# Altium schematic sheet SW 12.schdoc
size 349 x 127 mm; SheetNumber: 1; SheetTotal: 1
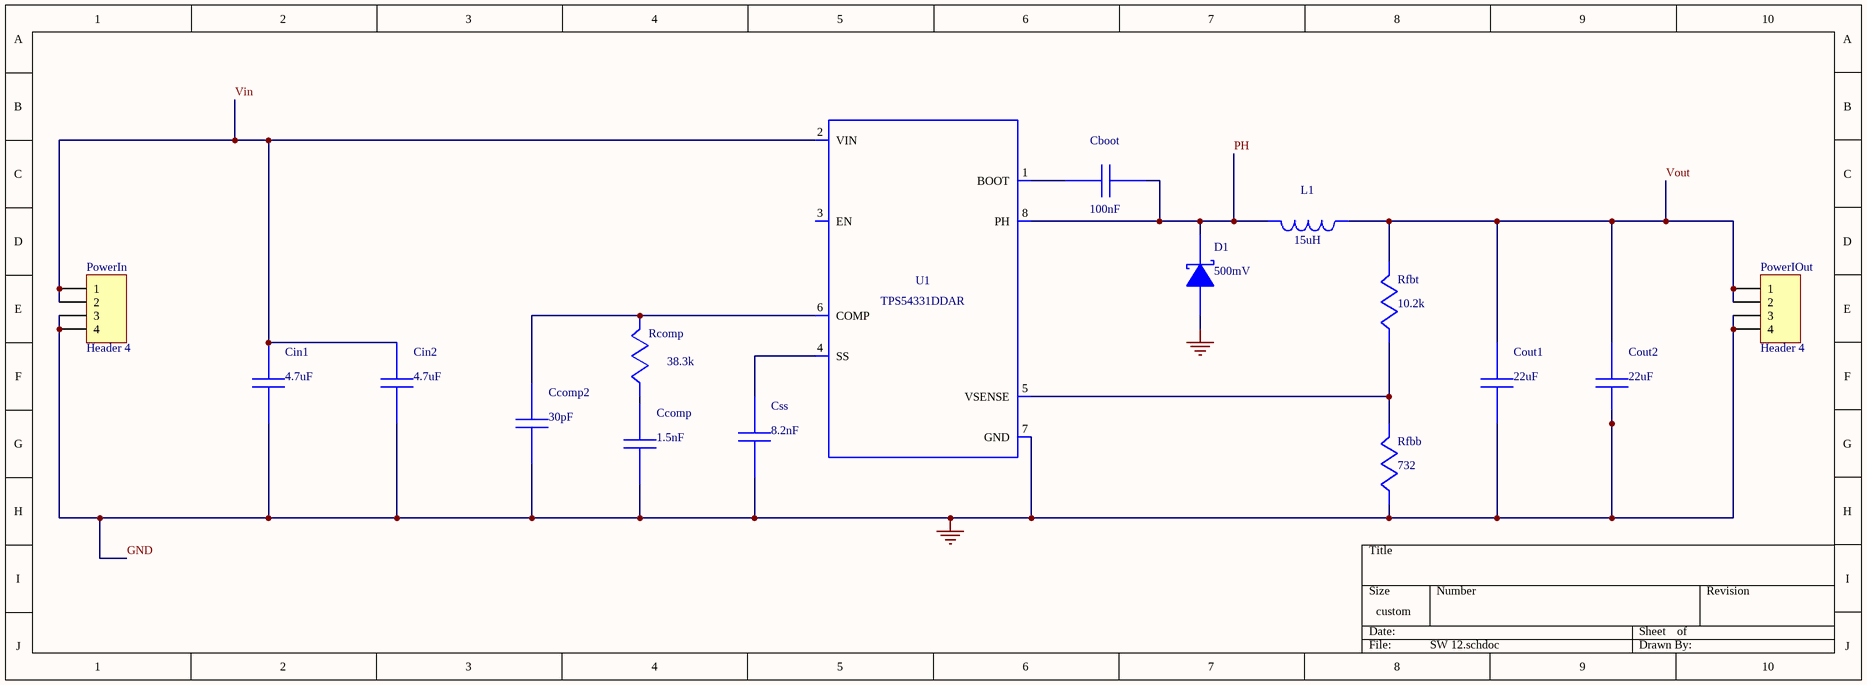
[diagram p0: SW 12.schdoc]

## Parts
Cboot  value 100nF  [1608[0603]]  (hidden comment: C1608X7R1E104K)
Ccomp  value 1.5nF  [6-0805_M]  (hidden comment: CC0805KRX7R9BB152)
Ccomp2  value 30pF  [6-0805_M]  (hidden comment: CL21C300JBANNNC)
Cin1  value 4.7uF  [C1210_M]  (hidden comment: GRM32ER71H475KA88L)
Cin2  value 4.7uF  [C1210_M]  (hidden comment: GRM32ER71H475KA88L)
Cout1  value 22uF  [C1210_M]  (hidden comment: GRM32ER61E226KE15L)
Cout2  value 22uF  [C1210_M]  (hidden comment: GRM32ER61E226KE15L)
Css  value 8.2nF  [0603]  (hidden comment: GRM188R71E822KA01D)
D1  value 500mV  [SMA Diode Package]  (hidden comment: B340A-13-F)
L1  value 15uH  [SRR1260]  (hidden comment: SRR1260-150M)
PowerIn  Header 4  [HDR1X4]
PowerIOut  Header 4  [HDR1X4]
Rcomp  value 38.3k  [6-0805_M]  (hidden comment: CRCW080538K3FKEA)
Rfbb  value 732  [6-0805_M]  (hidden comment: CRCW0805732RFKEA)
Rfbt  value 10.2k  [6-0805_M]  (hidden comment: CRCW080510K2FKEA)
U1  TPS54331DDAR  [TI-D8_N]

## Nets
GND: Ccomp.2 Ccomp2.2 Cin1.2 Cin2.2 Cout1.2 Cout2.2 Css.2 D1.2(A) PowerIn.3 PowerIn.4 PowerIOut.3 PowerIOut.4 Rfbb.2 U1.7(GND)  [also labelled 0]
PH: Cboot.2 D1.1(K) L1.1 U1.8(PH)
Vin: Cin1.1 Cin2.1 PowerIn.1 PowerIn.2 U1.2(VIN)
Vout: Cout1.1 Cout2.1 L1.2 PowerIOut.1 PowerIOut.2 Rfbt.1
NetCboot_1: Cboot.1 U1.1(BOOT)
NetCcomp2_1: Ccomp2.1 Rcomp.1 U1.6(COMP)
NetCcomp_1: Ccomp.1 Rcomp.2
NetCss_1: Css.1 U1.4(SS)
NetRfbb_1: Rfbb.1 Rfbt.2 U1.5(VSENSE)

Not connected (* = marked no-connect by the designer): U1 3(EN)

## Library data of the parts
Cboot = C1608X7R1E104K: Manufacturer Name: TDK; PackageReference: C1608X7R1E104K; Manufacturer Part Number: C1608X7R1E104K
Ccomp = CC0805KRX7R9BB152: CC0805KRX7R9BB15; Manufacturer Name: Yageo America; PackageReference: CC0805KRX7R9BB152; Manufacturer Part Number: CC0805KRX7R9BB152
Ccomp2 = CL21C300JBANNNC: Manufacturer Name: Samsung Electro-Mechanics; PackageReference: CL21C300JBANNNC; Manufacturer Part Number: CL21C300JBANNNC
Cin1 Cin2 = GRM32ER71H475KA88L: GRM32ER71H475KA8; Manufacturer Name: MuRata; PackageReference: GRM32ER71H475KA88L; Manufacturer Part Number: GRM32ER71H475KA88L
Cout1 Cout2 = GRM32ER61E226KE15L: GRM32ER61E226KE1; Manufacturer Name: MuRata; PackageReference: GRM32ER61E226KE15L; Manufacturer Part Number: GRM32ER61E226KE15L
Css = GRM188R71E822KA01D: GRM188R71E822KA0; Manufacturer Name: MuRata; PackageReference: GRM188R71E822KA01D; Manufacturer Part Number: GRM188R71E822KA01D
D1 = B340A-13-F: Manufacturer Name: Diodes Inc.; PackageReference: B340A-13-F; Manufacturer Part Number: B340A-13-F
L1 = SRR1260-150M: Manufacturer Name: Bourns; PackageReference: SRR1260-150M; Manufacturer Part Number: SRR1260-150M
PowerIn PowerIOut = Header 4: Header, 4-Pin; LatestRevisionDate: 17-Jul-2002; LatestRevisionNote: Re-released for DXP Platform.; Publisher: Altium Limited
Rcomp = CRCW080538K3FKEA: Manufacturer Name: Vishay-Dale; PackageReference: CRCW080538K3FKEA; Manufacturer Part Number: CRCW080538K3FKEA
Rfbb = CRCW0805732RFKEA: Manufacturer Name: Vishay-Dale; PackageReference: CRCW0805732RFKEA; Manufacturer Part Number: CRCW0805732RFKEA
Rfbt = CRCW080510K2FKEA: Manufacturer Name: Vishay-Dale; PackageReference: CRCW080510K2FKEA; Manufacturer Part Number: CRCW080510K2FKEA
U1 = TPS54331DDAR: Manufacturer Name: Texas Instruments; Value: UNLISTED; PackageReference: TPS54331DDAR; Manufacturer Part Number: TPS54331DDAR